# Altium schematic sheet Astable_Sheet.SchDoc
size A4; SheetNumber: 1; SheetTotal: 1
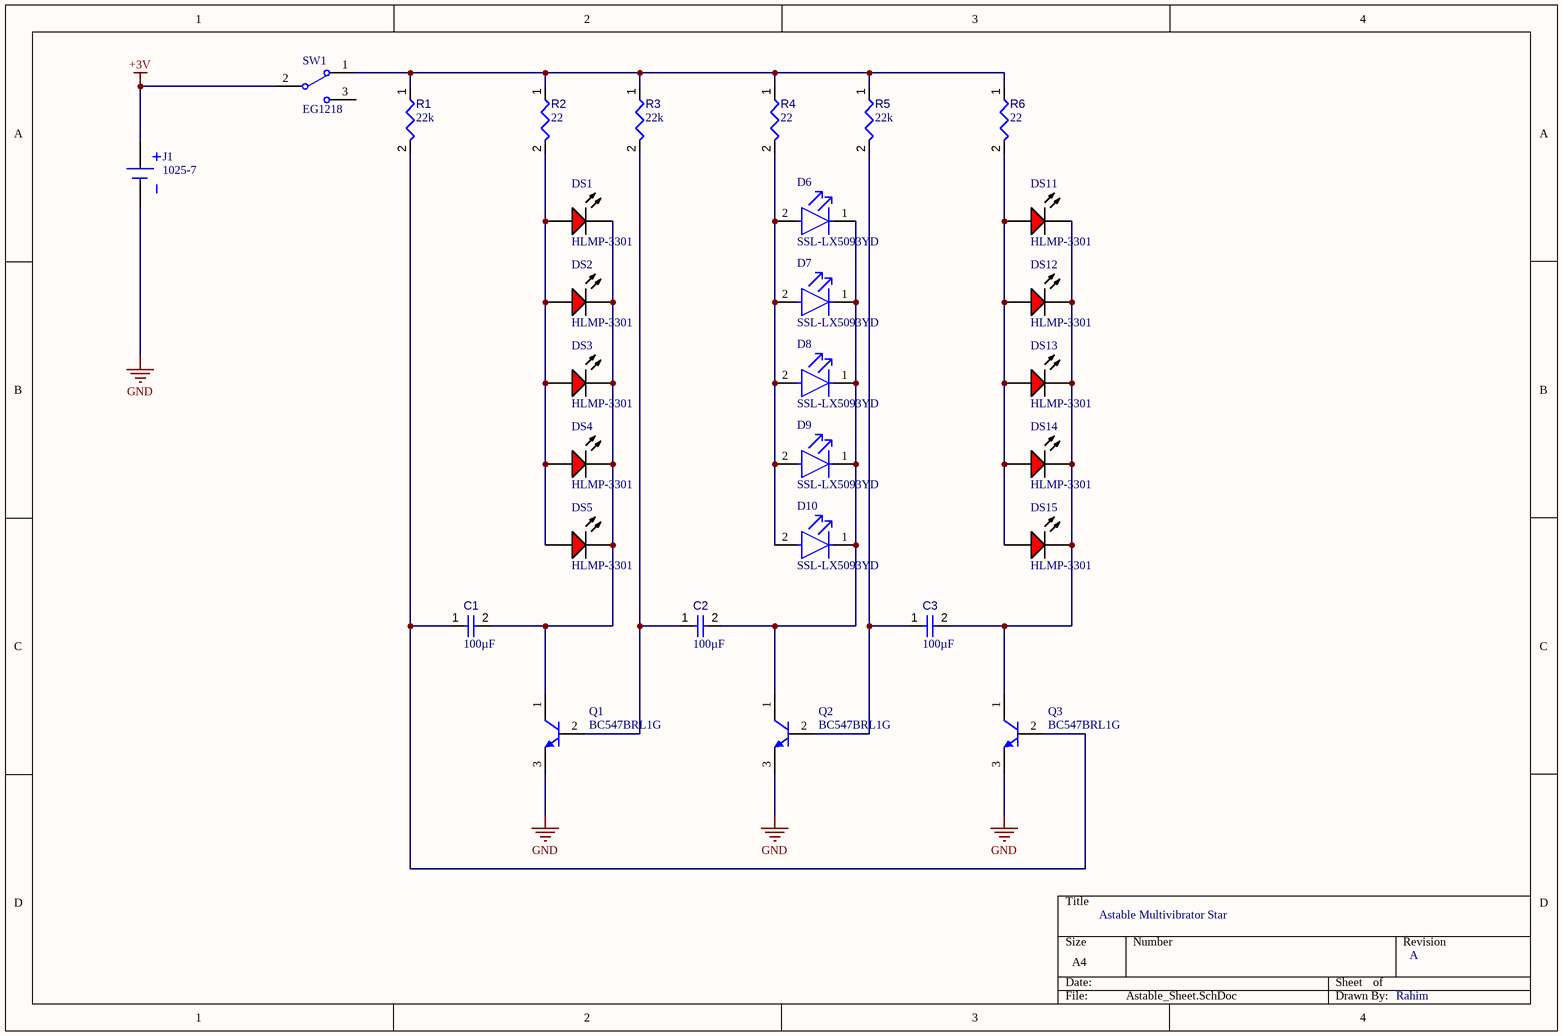
[diagram p0: Astable_Sheet.SchDoc]

## Parts
C1  value 100µF  [CAPC0805(2012)145_L]  (hidden comment: Capacitor 100µF +/-20% 6.3V 0805)
C2  value 100µF  [CAPC0805(2012)145_L]  (hidden comment: Capacitor 100µF +/-20% 6.3V 0805)
C3  value 100µF  [CAPC0805(2012)145_L]  (hidden comment: Capacitor 100µF +/-20% 6.3V 0805)
D6  SSL-LX5093YD  [FP-SSL-LX5093YD-MFG]
D7  SSL-LX5093YD  [FP-SSL-LX5093YD-MFG]
D8  SSL-LX5093YD  [FP-SSL-LX5093YD-MFG]
D9  SSL-LX5093YD  [FP-SSL-LX5093YD-MFG]
D10  SSL-LX5093YD  [FP-SSL-LX5093YD-MFG]
DS1  HLMP-3301  [AVAG-HLMP-3301-2]
DS2  HLMP-3301  [AVAG-HLMP-3301-2]
DS3  HLMP-3301  [AVAG-HLMP-3301-2]
DS4  HLMP-3301  [AVAG-HLMP-3301-2]
DS5  HLMP-3301  [AVAG-HLMP-3301-2]
DS11  HLMP-3301  [AVAG-HLMP-3301-2]
DS12  HLMP-3301  [AVAG-HLMP-3301-2]
DS13  HLMP-3301  [AVAG-HLMP-3301-2]
DS14  HLMP-3301  [AVAG-HLMP-3301-2]
DS15  HLMP-3301  [AVAG-HLMP-3301-2]
J1  1025-7  [KEYSTONE-1025-7-2_V]
Q1  BC547BRL1G  [ONSC-TO-92-3-29-11_AM_BL]
Q2  BC547BRL1G  [ONSC-TO-92-3-29-11_AM_BL]
Q3  BC547BRL1G  [ONSC-TO-92-3-29-11_AM_BL]
R1  value 22k  [RESC0402(1005)_L]  (hidden comment: 22KR2F)
R2  value 22  [RESC1609X50X30ML08T20]  (hidden comment: Resistor 22R +/-1% 0603 100 mW)
R3  value 22k  [RESC0402(1005)_L]  (hidden comment: 22KR2F)
R4  value 22  [RESC1609X50X30ML08T20]  (hidden comment: Resistor 22R +/-1% 0603 100 mW)
R5  value 22k  [RESC0402(1005)_L]  (hidden comment: 22KR2F)
R6  value 22  [RESC1609X50X30ML08T20]  (hidden comment: Resistor 22R +/-1% 0603 100 mW)
SW1  EG1218  [ESWI-EG1218_V]

## Nets
+3V: J1.1(+) SW1.2(COM)
GND: J1.2(-) Q1.3(E) Q2.3(E) Q3.3(E)
NetC1_1: C1.1 Q3.2(B) R1.2
NetC1_2: C1.2 DS1.1(K) DS2.1(K) DS3.1(K) DS4.1(K) DS5.1(K) Q1.1(C)
NetC2_1: C2.1 Q1.2(B) R3.2
NetC2_2: C2.2 D6.1(C) D7.1(C) D8.1(C) D9.1(C) D10.1(C) Q2.1(C)
NetC3_1: C3.1 Q2.2(B) R5.2
NetC3_2: C3.2 DS11.1(K) DS12.1(K) DS13.1(K) DS14.1(K) DS15.1(K) Q3.1(C)
NetD6_2: D6.2(A) D7.2(A) D8.2(A) D9.2(A) D10.2(A) R4.2
NetDS1_2: DS1.2(A) DS2.2(A) DS3.2(A) DS4.2(A) DS5.2(A) R2.2
NetDS11_2: DS11.2(A) DS12.2(A) DS13.2(A) DS14.2(A) DS15.2(A) R6.2
NetR1_1: R1.1 R2.1 R3.1 R4.1 R5.1 R6.1 SW1.1

Not connected (* = marked no-connect by the designer): SW1 3

## Notes on the sheet
- Astable Multivibrator Star
- A
- Rahim

## Library data of the parts
C1-C3 = CMP-001-00054-4: Chip Capacitor, 100µF +/-20%, 6.3V, 0805, Thickness 1.45 mm; Tolerance: 10%; Min Operating Temperature: -55°C; Max Operating Temperature: 85°C; Pins: 2; Mounting Technology: SMT; Case/Package: 0805; Voltage Rating: 6.3V
D6-D10 = CMP-57192-000007-1: LED YELLOW DIFFUSED T-1 3/4 T/H; Test Current: 20mA; Number of LEDs: 1; Dominant Wavelength: 568nm; Wavelength: 585nm; Forward Voltage: 2.1V; Lens Style: Dome; Viewing Angle: 60°; Luminous Intensity: 30mcd; Min Operating Temperature: -40°C; Packaging: Bulk; Width: 1.5inch; Lead Free: Lead Free; Number of Pins: 2; Color: Yellow; Case/Package: Radial; Forward Current: 20mA; REACH SVHC: No SVHC; Lens Transparency: Diffused; Weight: 0.01lb; Height: 8.6mm; Package Quantity: 1000; Series: -; Length: 0.5inch; Illumination Color: Yellow; Mount: Through Hole; Diameter: 5mm; RoHS Compliant: Yes; Lens Color: Yellow; Max Operating Temperature: 85°C
DS1-DS5 DS11-DS15 = CMP-2000-06411-1: T-1 3/4 (5 mm) Diffused LED Lamp, 1.9 V, -40 to 100 degC, 2-Pin THD, RoHS, Bulk; Manufacturer: Avago; Forward Current: 25mA; Forward Voltage: 2.4V; Peak Wavelength: 635nm; Shape Type: Circular; High Brightness: No; Main Category: StandardLED; Test Current (It): 10mA; Dominant Wave Length: 626nm; Number of  Elements: 1; Reverse Voltage: 5V; Chip Material: GaP; Product Height (mm): 9.19mm; Lens Type: ColoredDiffused; Viewing Angle: 60deg; Type: Uni-Color; Emitting Color: Red; Luminous Intensity: 5.4mcd; Power Dissipation: 85W; DELETED: Compliant; Product Depth (mm): 6.1mm; Package Description: 2-Pin Through Hole LED, Dia 5.85 mm; Mounting Technology: ThroughHole; Manufacturer URL: http://www.avagotech.com/; Package Type: T-13/4; Operating Temp Range: -40Cto100C; Datasheet URL: http://www.avagotech.com/docs/AV02-1558EN; Mounting: ThroughHole; Lens Dimensions: 5.08x5.08x8.3mm; Package Reference: HLMP-3301; Datasheet Version: 03/2015; Pin Count: 2; Packaging: TapeandReel; Operating Temperature Classification: Industrial; Lum Intensity: 5.4mcd; Rad Hardened: No; Product Length (mm): 6.1mm
J1 = CMP-0465-00001-2: Holder for 2477 or 2430 Cells P/N 1025-7, Body 27.762 x 30.963 mm, THM; Manufacturer: Keystone; # of Cells: 1; Cell Size: 24 mm; ComponentLink1Description: Manufacturer URL; PackageDescription: 2-Pin Hand Drawn, Body 27.762 x 30.963 mm; Material: Plastic; ComponentLink1URL: http://www.keyelco.com/; Type: HOLDER; ComponentLink2URL: http://www.keyelco.com/product-pdf.cfm?p=3950; Switch Current Limit (Typ) (A): 1; PartNumber: 1025-7; ComponentLink2Description: Datasheet; PackageReference: KEYSTONE-1025-7-2; DatasheetVersion: Rev.C; Mounting Technology: Through Hole
Q1-Q3 = CMP-1048-01605-1: Amplifier Transistor, NPN Silicon, 3-Pin TO-92, Pb-Free, Tape and Reel; Manufacturer: On Semiconductor; IC Continuous (A): 0.1; fT Min (MHz): 150; ComponentLink2URL: http://www.onsemi.com/pub_link/Collateral/BC546-D.PDF; ComponentLink1URL: http://www.onsemi.com/; ComponentLink2Description: Datasheet; RoHS: TRUE; ComponentLink3Description: Package Specification; ComponentLink1Description: Manufacturer URL; ComponentLink3URL: http://www.onsemi.com/pub_link/Collateral/MAC97-D.PDF; PackageDescription: 3-Pin Transistor Outline, Body 4.825 x 3.685 mm, Pitch 1.27 mm; Packing: Tape and Reel; PackageVersion: Rev. AM; Polarity: NPN; DatasheetVersion: Rev. 7; Mounting Technology: Through Hole; PackageReference: TO-92-3-29-11_AM_BL; PartNumber: BC547BRL1G
R1 R3 R5 = CMP-009-00081-2: 22K 0.063W 1% 0402 (1005 Metric)  SMD; Power: 63mW; Tolerance: 1%; Pins: 2; Mounting Technology: SMT; Case/Package: 0402
R2 R4 R6 = CMP-009-00027-5: Chip Resistor, 22 Ohm, +/- 1%, 100 mW, -55 to 155 degC, 0603 (1608 Metric); Power: 100mW; Voltage Rating: 75V; Max Operating Temperature: 155°C; Min Operating Temperature: -55°C; Tolerance: 1%; RoHS Compliant: True; Mounting Technology: SM; Case/Package: 0603; Pins: 2
SW1 = CMP-011-00006-2: Slide Switch, SPDT, 500 V, -20 to 70 degC, 3-Pin THD, RoHS, Bulk; Manufacturer: E-Switch; Voltage Rating (DC): 30V; Current Rating: 200mA; Operating Force: 250gf; Package Quantity: 1000; Contact Plating: Silver; Max Operating Temperature: 70°C; Min Operating Temperature: -20°C; Contact Material: Copper; Datasheet URL: https://www.e-switch.com/system/asset/product_line/data_sheet/119/EG.pdf; Contact Finish: Silver; Case/Package: EG1218; Voltage Rating (AC): 30V; Datasheet Version: Oct-15; Package Description: 3-Pin Through Hole Device, Body 11.6 x 4 mm, Pitch 2.5 mm; RoHS Compliant: True; Package Reference: EG1218; Manufacturer URL: http://www.e-switch.ch/en/; Throw Configuration: SPDT; Contact Current Rating: 200mA; Mounting Technology: TH; Packaging: Bulk; Pins: 3